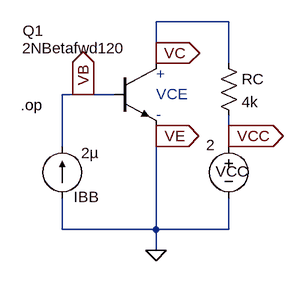
[diagram p0: schematic prob5_20b.asc]
prob5_20b.asc, the LTspice schematic file:
Version 4
SHEET 1 880 680
WIRE 320 64 208 64
WIRE 208 112 208 64
WIRE 208 128 208 112
WIRE 320 128 320 64
WIRE 96 176 64 176
WIRE 144 176 96 176
WIRE 208 240 208 224
WIRE 320 240 320 208
WIRE 64 256 64 176
WIRE 320 256 320 240
WIRE 64 384 64 336
WIRE 208 384 208 240
WIRE 208 384 64 384
WIRE 320 384 320 336
WIRE 320 384 208 384
WIRE 208 416 208 384
FLAG 208 416 0
FLAG 208 112 VC
IOPIN 208 112 Out
FLAG 208 240 VE
IOPIN 208 240 Out
FLAG 96 176 VB
IOPIN 96 176 Out
FLAG 320 240 VCC
IOPIN 320 240 Out
SYMBOL npn 144 128 R0
WINDOW 0 -141 -50 Left 2
WINDOW 3 -142 -23 Left 2
SYMATTR InstName Q1
SYMATTR Value 2NBetafwd120
SYMBOL voltage 320 240 R0
WINDOW 0 -20 55 Left 2
WINDOW 3 -35 14 Left 2
SYMATTR InstName VCC
SYMATTR Value 2
SYMBOL res 304 112 R0
SYMATTR InstName RC
SYMATTR Value 4k
SYMBOL current 64 336 R180
WINDOW 0 -56 2 Left 2
WINDOW 3 -56 70 Left 2
SYMATTR InstName IBB
SYMATTR Value 2µ
TEXT 0 192 Left 2 !.op
TEXT 208 144 Left 2 ;+\nVCE\n-

The netlist it stands for:
* prob5_20b.asc
Q1 VC VB 0 0 2NBetafwd120
VCC VCC 0 2
RC VC VCC 4k
IBB 0 VB 2µ
.model NPN NPN
.model PNP PNP
.lib standard.bjt
.op
* +
* VCE
* -
.backanno
.end

* Results of the author's LTspice run, read from the files saved beside the schematic
* Operating Point:
*   V(vc) = 1.037 V
*   V(vb) = 618.3 mV
*   V(vcc) = 2 V
*   Ic(Q1) = 240.8 µA
*   Ib(Q1) = 2 µA
*   Ie(Q1) = -242.8 µA
*   I(Ibb) = 2 µA
*   I(Rc) = -240.8 µA
*   I(Vcc) = -240.8 µA